# EAGLE design DCO_PIGGY (EAGLE 6.4)
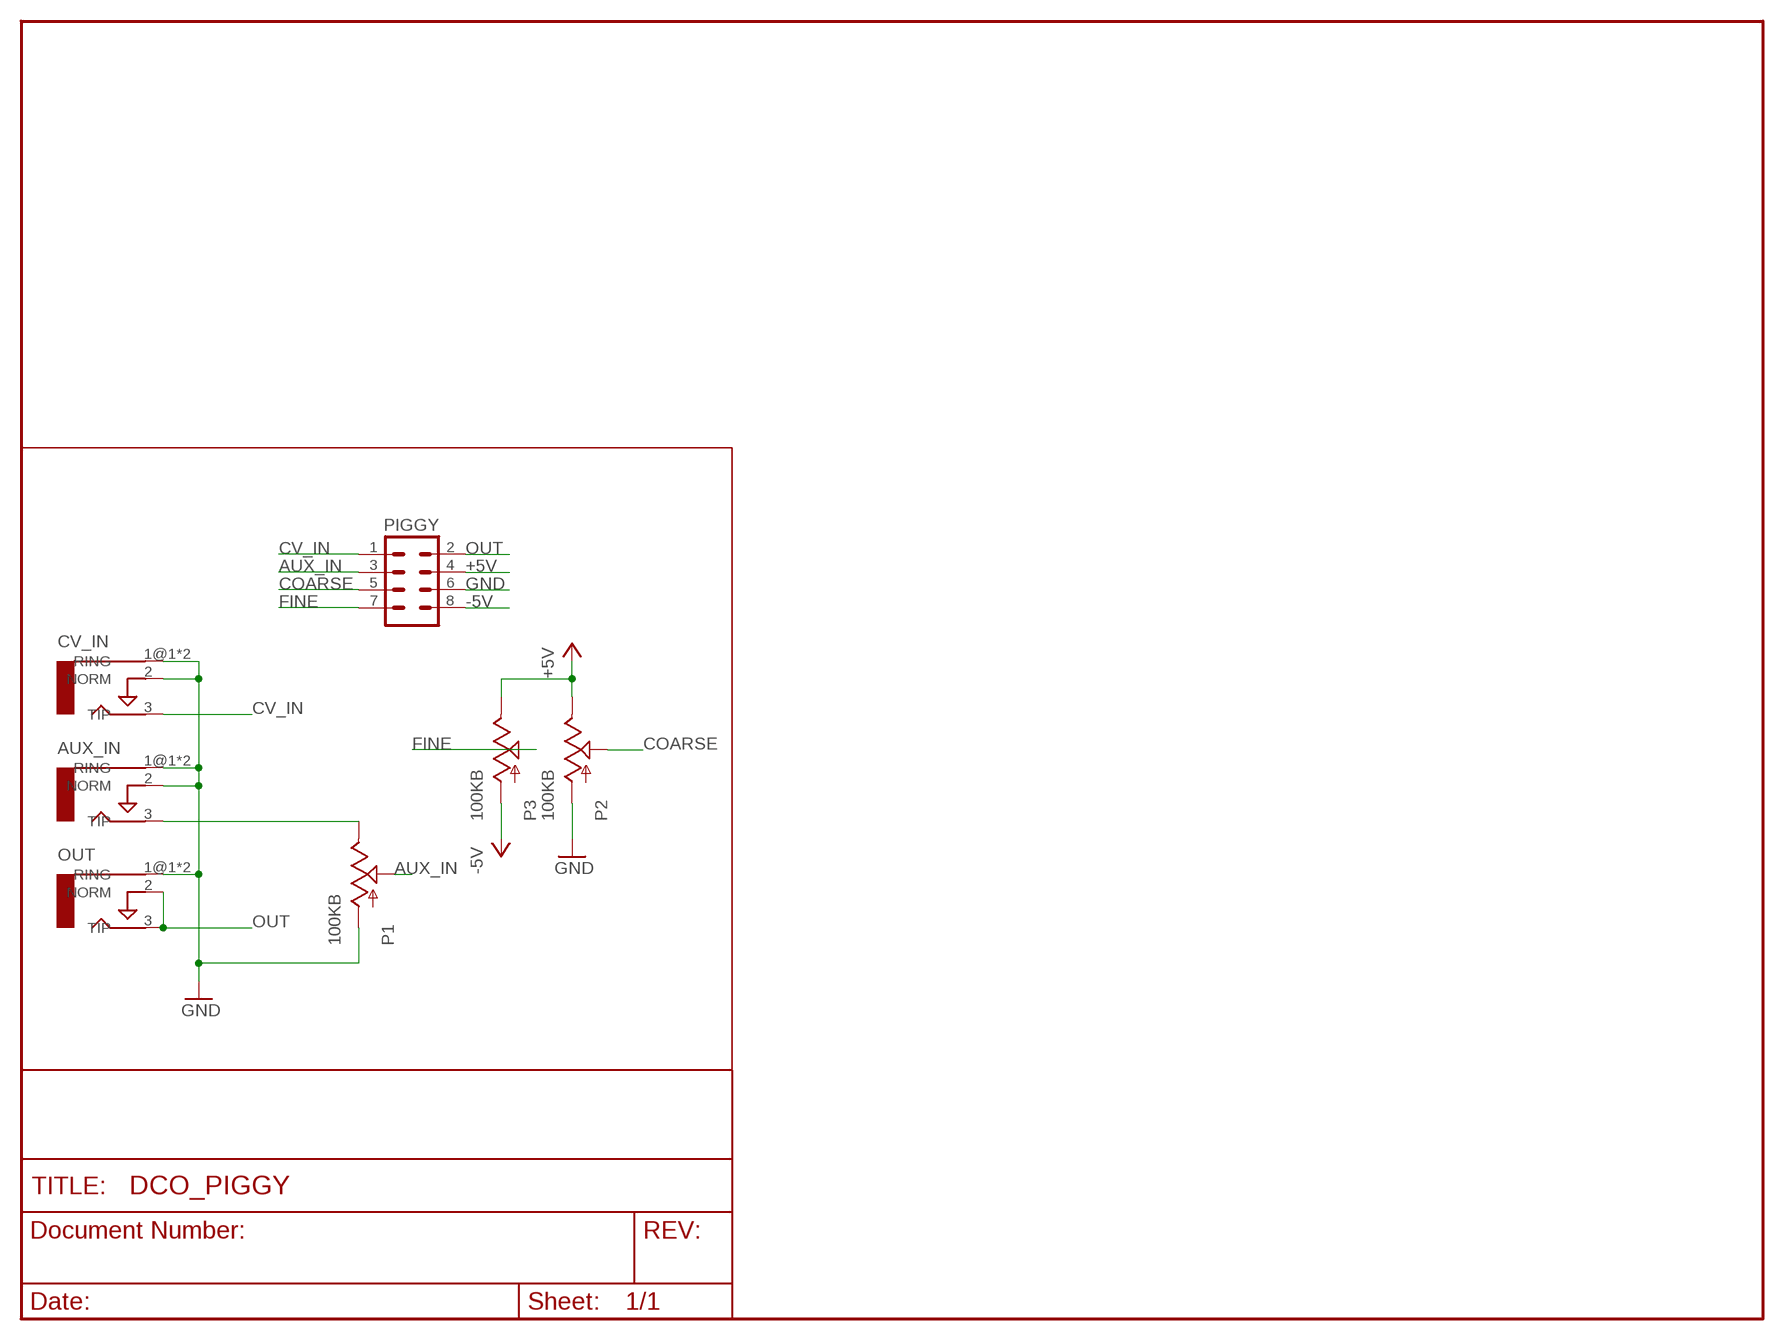
[diagram p0: schematic, sheet 1]

## Parts
AUX_IN  AUDIO-JACKERTHENVAR  [ERTHENVAR-JACK]
CV_IN  AUDIO-JACKERTHENVAR  [ERTHENVAR-JACK]
OUT  AUDIO-JACKERTHENVAR  [ERTHENVAR-JACK]
P1  100KB  POTPDB12  [PDB12]
P2  100KB  POTPDB12  [PDB12]
P3  100KB  POTPDB12  [PDB12]
PIGGY  M04X2  [2X4]

## Nets
+5V: P2.3(E) P3.3(E) PIGGY.4
-5V: P3.1(A) PIGGY.8
AUX_IN: P1.2(S) PIGGY.3
COARSE: P2.2(S) PIGGY.5
CV_IN: CV_IN.3(TIP) PIGGY.1
FINE: P3.2(S) PIGGY.7
GND: AUX_IN.1@1(RING) AUX_IN.1@2(RING) AUX_IN.2(NORM) CV_IN.1@1(RING) CV_IN.1@2(RING) CV_IN.2(NORM) OUT.1@1(RING) OUT.1@2(RING) P1.1(A) P2.1(A) PIGGY.6
N$3: AUX_IN.3(TIP) P1.3(E)
OUT: OUT.2(NORM) OUT.3(TIP) PIGGY.2

## Library data of the parts
AUX_IN CV_IN OUT = erthenvar:AUDIO-JACK: Switching Mono 3.5mm Audio Jack from Erthenvar.
P1-P3 = SparkFun:POT
PIGGY = SparkFun:M04X2

## Board
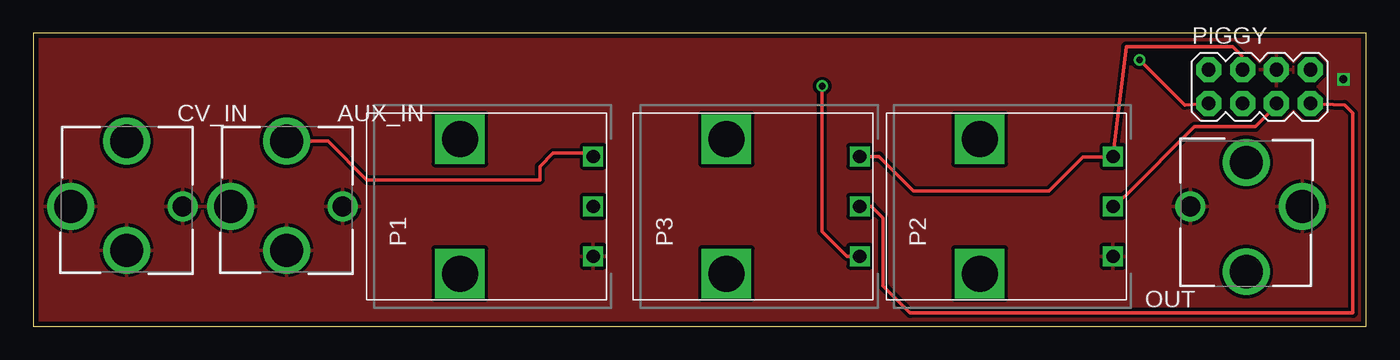
[diagram p1: board, top side]
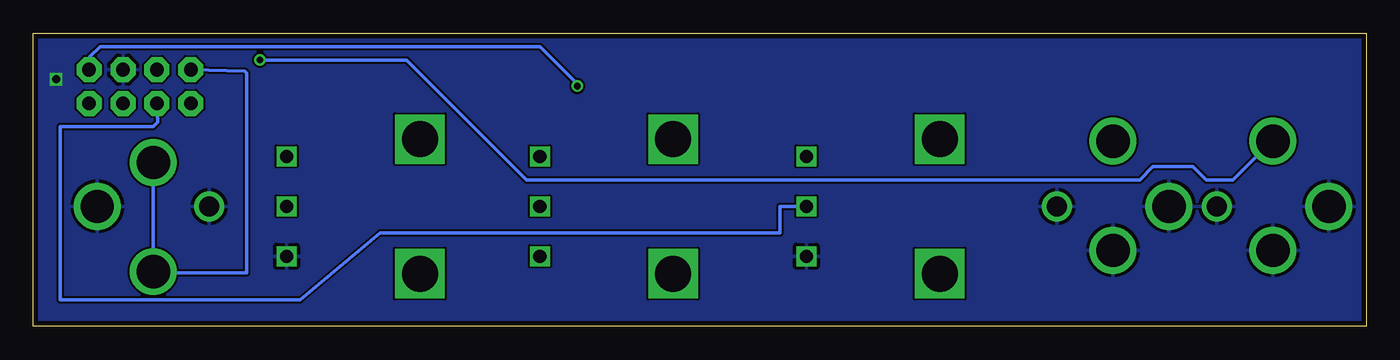
[diagram p2: board, bottom side, seen from below]

Size 100 x 22 mm. Coordinates in mm from the lower left corner, seen from the top.
Outline: 0,0 100,0 100,22 0,22 0,0
Copper layers (1*16): Top 0.0356mm / dielectric 1.5011mm / Bottom 0.0356mm
Design rules "default": minimum track width 6mil, minimum drill 13mil, track to track 6mil, track to pad 6mil, pad to pad 6mil, via to via 6mil, smd to smd 6mil, copper to edge 15mil, drill to drill 6mil, minimum pad ring 7mil, minimum via ring 7mil, stop-mask expansion 4mil, vias tented up to drill 0mil, thermal gap 10mil

### Footprints (pad centres in the part's own frame; a part is rotated, then mirrored left to right if it is on the bottom)
ERTHENVAR-JACK = drill 2.5: 1@1 -4.2,0; 2 0,-3.3; 3 0,4.9 | drill 1.5: 1@2 4.2,0
PDB12 = drill 1 square: 1 -3.75,-10; 2 0,-10; 3 3.75,-10 | drill 2.7 square: P$4 5.05,0; P$5 -5.05,0
2X4 = drill 1.016 pad 1.88 octagon: 1 -3.81,-1.27; 2 -3.81,1.27; 3 -1.27,-1.27; 4 -1.27,1.27; 5 1.27,-1.27; 6 1.27,1.27; 7 3.81,-1.27; 8 3.81,1.27

### Placement (x,y rotation side)
AUX_IN  19,9 0 top
CV_IN  7,9 0 top
OUT  91,9 180 top
P1  32,9 90 top
P2  71,9 90 top
P3  52,9 90 top
PIGGY  92,18 0 top

### Tracks (layer width: path | path; a pad name or v marks a point on that pad's centre or on a via)
+5V
  Top 0.254: PIGGY.4 90.68,20.32 90,21 82,21 P2.3 80.95,12.7 78.74,12.7 76.2,10.16 66.04,10.16 63.45,12.75 P3.3
-5V  (via drill 0.51)
  Top 0.254: P3.1 61.04,5.25 59.18,7.11 v59.18,18.03 59.18,18.18
  Bottom 0.254: PIGGY.8 95.76,20.24 95,21 62,21 59.18,18.18 v59.18,18.03
AUX_IN
  Bottom 0.254: PIGGY.3 90.68,15.32 91,15 98,15 98,2 80,2 74,7 44,7 44,9 P1.2
COARSE
  Top 0.254: P2.2 82,9.86 87.12,14.99 91.69,14.99 92.96,16.26 92.96,16.42 PIGGY.5
CV_IN  (via drill 0.51)
  Top 0.254: PIGGY.1 86.39,16.61 v83,20
  Bottom 0.254: v83,20 72,20 63,11 17,11 16,12 13,12 12,11 10,11 7,14 CV_IN.3
FINE
  Top 0.254: PIGGY.7 98.39,16.61 99,16 99,1 65.79,1 63.75,3.03 63.75,8.13 62.88,9 P3.2
GND  (via drill 0.6)
  other vias: 98.3,18.54
  pour Top (isolate 0.254): 0,22 0,0 100,0 100,22
  pour Bottom: 0,22 0,0 100,0 100,22
N$3
  Top 0.254: AUX_IN.3 22.1,13.9 25,11 38,11 38,12 39,13 42,13 P1.3
OUT
  Bottom 0.254: PIGGY.2 84.15,19.15 84,19 84,4 91,4 OUT.3 OUT.2